# Altium project Cubesat_BMS.PrjPcb (part 1 of 2)
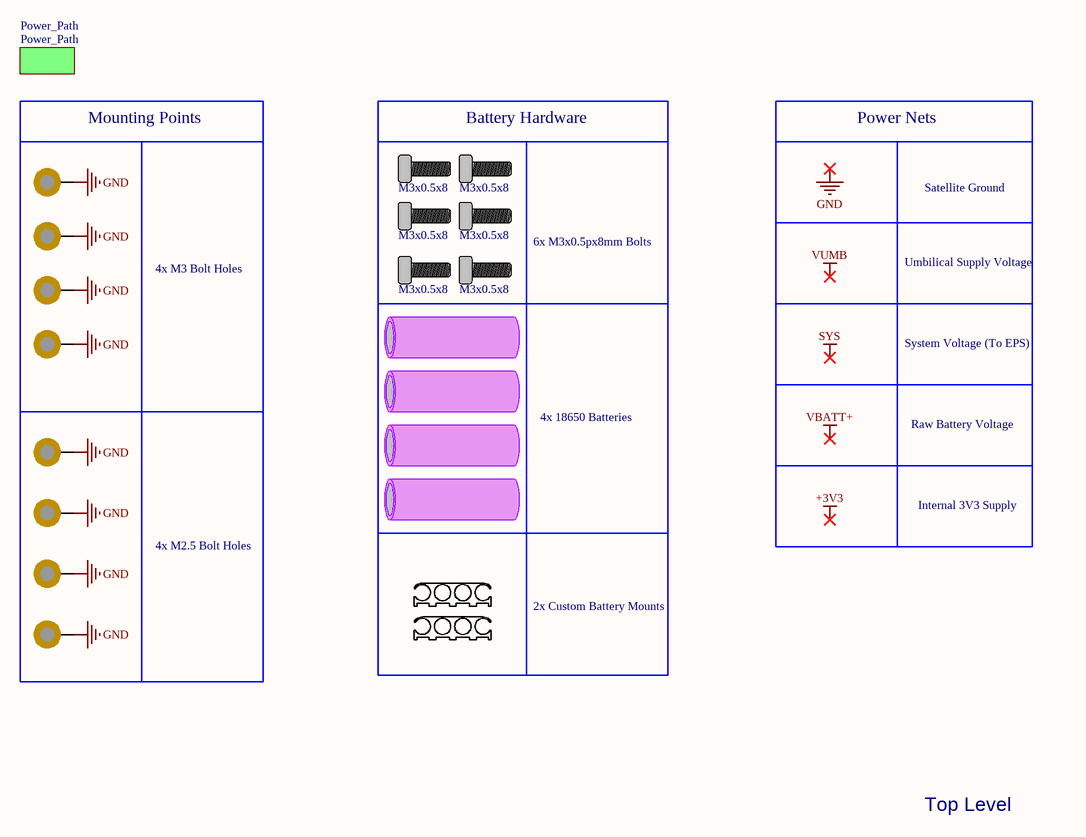
[diagram p0: Top_Level.SchDoc]
Engineer: TH; PCB_Name: BMS; Revision: 1
9 sheets, 235 parts. Net scope: flat (ports and power ports of the same name join across sheets).
Board file: BMS.PcbDoc
Sheets:
  Top_Level.SchDoc
    Power_Path = Power_Path.SchDoc
      Battery = Battery_Protection.SchDoc
      Battery_eFuse = Battery_eFuse.SchDoc
      Umbilical_eFuse = Umbilical_eFuse.SchDoc
      Charger = Charger.SchDoc
      MPPT = MPPT.SchDoc
      Controller = Controller.SchDoc
      Step_Down = Step_Down.SchDoc

## Sheet Top_Level.SchDoc
size 297 x 209 mm; SheetNumber: 1; SheetTotal: 9

### Parts
BAT1  INR18650-35E  (value not drawn)  (mechanical)
BAT2  INR18650-35E  (value not drawn)  (mechanical)
BAT3  INR18650-35E  (value not drawn)  (mechanical)
BAT4  INR18650-35E  (value not drawn)  (mechanical)
MECH1  M3 Mounting Hole  [M3 Mounting Hole]  (value not drawn)  (no BOM)
MECH2  M3 Mounting Hole  [M3 Mounting Hole]  (value not drawn)  (no BOM)
MECH3  M3 Mounting Hole  [M3 Mounting Hole]  (value not drawn)  (no BOM)
MECH4  M3 Mounting Hole  [M3 Mounting Hole]  (value not drawn)  (no BOM)
MECH5  M3x0.5x8  [M3 x 0.50p x 8mm Bolt]
MECH6  M3x0.5x8  [M3 x 0.50p x 8mm Bolt]
MECH7  M3x0.5x8  [M3 x 0.50p x 8mm Bolt]
MECH8  M3x0.5x8  [M3 x 0.50p x 8mm Bolt]
MECH9  M3x0.5x8  [M3 x 0.50p x 8mm Bolt]
MECH10  M3x0.5x8  [M3 x 0.50p x 8mm Bolt]
MECH11  M2.5 Mounting Hole  [M2.5 Mounting Hole]  (value not drawn)
MECH12  M2.5 Mounting Hole  [M2.5 Mounting Hole]  (value not drawn)
MECH13  M2.5 Mounting Hole  [M2.5 Mounting Hole]  (value not drawn)
MECH14  M2.5 Mounting Hole  [M2.5 Mounting Hole]  (value not drawn)

### Blocks framed on the sheet
Mounting Points: MECH1-MECH4
Battery Hardware: BAT1-BAT4 MECH5-MECH10
4x M2.5 Bolt Holes: MECH11-MECH14

### Sub-sheets
Power_Path = Power_Path: no entries

### Nets
GND: MECH1.1 MECH2.1 MECH3.1 MECH4.1 MECH11.1 MECH12.1 MECH13.1 MECH14.1

### Notes on the sheet
- Power Nets
- Satellite Ground
- 6x M3x0.5px8mm Bolts
- Umbilical Supply Voltage
- 4x M3 Bolt Holes
- System Voltage (To EPS)
- 4x 18650 Batteries
- Raw Battery Voltage
- Internal 3V3 Supply
- 2x Custom Battery Mounts
- Top Level
- Labels drawn without touching a wire or pin: +3V3, GND, SYS, VBATT+, VUMB
- Size:
- Title:
- A4
- Project:
- Rev:
- Date:
- Drawn By:
- Sheet:
- of

### Library data of the parts
BAT1-BAT4 = INR18650-35E: Samsung 3500mAh 18650 Li-Ion battery; Continuous Current: 3.5A; Part Number: INR18650-35E; Distributor Part Number: SB2632; Distributor: Jaycar; Capacity: 3500mAh; Operating Temperature: 0°C to 50°C
MECH5-MECH10 = M3x0.5px8mm Bolt: M3 x 0.50p x 8mm Full Thread Metric Coarse Socket Head Cap Screw (2.5mm Key) A4-70 Stainless G316 DIN 912 / ISO 4762; Part Number: M3 x 0.50p x 8mm; Distributor: Bolt and Nut Australia; Distributor Part Number: M3 x 0.50p x 8mm

## Sheet Power_Path.SchDoc
size 297 x 209 mm; SheetNumber: 2; SheetTotal: 9
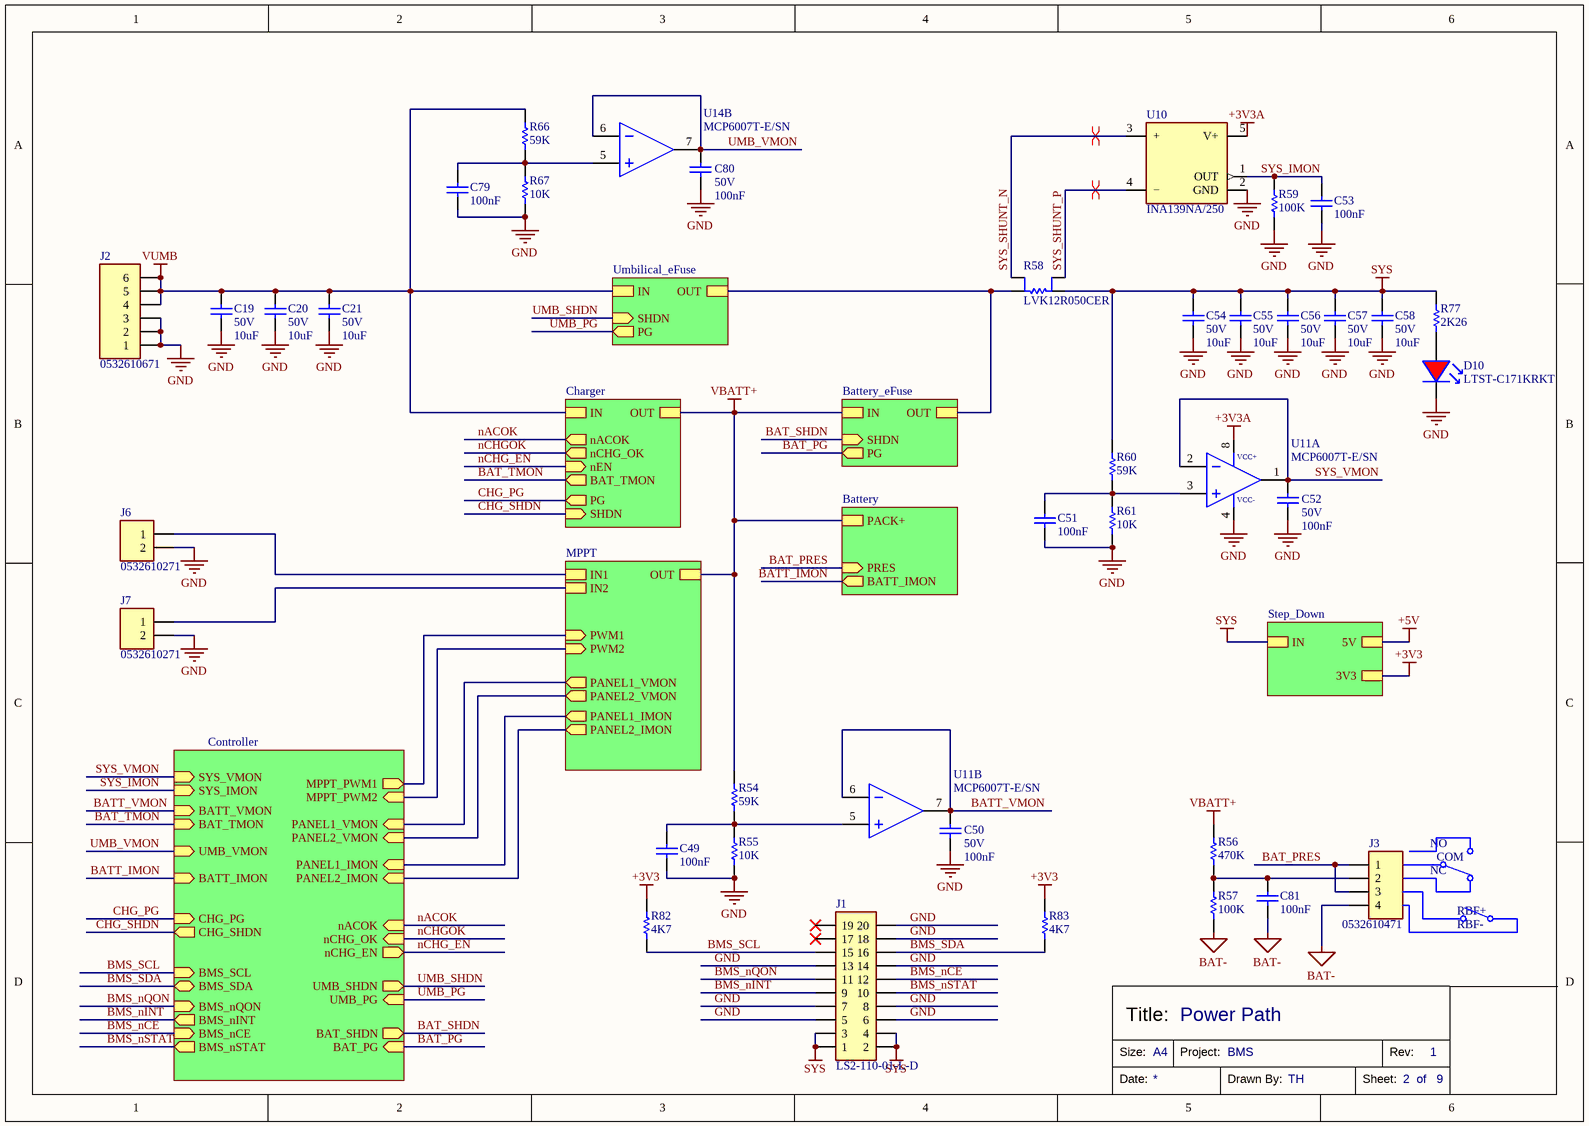
[diagram p1: Power_Path.SchDoc]

### Parts
C19  Voltage Rating: 50V  Capacitance: 10uF  [CAPC1210X090]  (hidden comment: CL32B106KBJNNNE)
C20  Voltage Rating: 50V  Capacitance: 10uF  [CAPC1210X090]  (hidden comment: CL32B106KBJNNNE)
C21  Voltage Rating: 50V  Capacitance: 10uF  [CAPC1210X090]  (hidden comment: CL32B106KBJNNNE)
C49  Capacitance: 100nF  [CAPC0603X040]  (hidden comment: C0603C104K5RACTU)
C50  Voltage Rating: 50V  Capacitance: 100nF  [CAPC0603X040]  (hidden comment: C0603C104K5RACTU)
C51  Capacitance: 100nF  [CAPC0603X040]  (hidden comment: C0603C104K5RACTU)
C52  Voltage Rating: 50V  Capacitance: 100nF  [CAPC0603X040]  (hidden comment: C0603C104K5RACTU)
C53  Capacitance: 100nF  [CAPC0603X040]  (hidden comment: C0603C104K5RACTU)
C54  Voltage Rating: 50V  Capacitance: 10uF  [CAPC1210X090]  (hidden comment: CL32B106KBJNNNE)
C55  Voltage Rating: 50V  Capacitance: 10uF  [CAPC1210X090]  (hidden comment: CL32B106KBJNNNE)
C56  Voltage Rating: 50V  Capacitance: 10uF  [CAPC1210X090]  (hidden comment: CL32B106KBJNNNE)
C57  Voltage Rating: 50V  Capacitance: 10uF  [CAPC1210X090]  (hidden comment: CL32B106KBJNNNE)
C58  Voltage Rating: 50V  Capacitance: 10uF  [CAPC1210X090]  (hidden comment: CL32B106KBJNNNE)
C79  Capacitance: 100nF  [CAPC0603X040]  (hidden comment: C0603C104K5RACTU)
C80  Voltage Rating: 50V  Capacitance: 100nF  [CAPC0603X040]  (hidden comment: C0603C104K5RACTU)
C81  Capacitance: 100nF  [CAPC0603X040]  (hidden comment: C0603C104K5RACTU)
D10  LTST-C171KRKT  [LEDR_0805]
J1  LS2-110-01-L-D  [LS2-110-01-L-D]
J2  0532610671  [0532610671]
J3  0532610471  [0532610471]
J6  0532610271  [0532610271]
J7  0532610271  [0532610271]
R54  Resistance: 59K  [RESC0603]  (hidden comment: RMCF0603FT59K0)
R55  Resistance: 10K  [RESC0603]  (hidden comment: RMCF0603FT10K0)
R56  Resistance: 470K  [RESC0603]  (hidden comment: RMCF0603FT470K)
R57  Resistance: 100K  [RESC0603]  (hidden comment: RMCF0603FT100K)
R58  LVK12R050CER  [LVK12R050CER-1]
R59  Resistance: 100K  [RESC0603]  (hidden comment: RMCF0603FT100K)
R60  Resistance: 59K  [RESC0603]  (hidden comment: RMCF0603FT59K0)
R61  Resistance: 10K  [RESC0603]  (hidden comment: RMCF0603FT10K0)
R66  Resistance: 59K  [RESC0603]  (hidden comment: RMCF0603FT59K0)
R67  Resistance: 10K  [RESC0603]  (hidden comment: RMCF0603FT10K0)
R77  Resistance: 2K26  [RESC0603]  (hidden comment: RMCF0603FT2K26)
R82  Resistance: 4K7  [RESC0603]  (hidden comment: RMCF0603FT4K7)
R83  Resistance: 4K7  [RESC0603]  (hidden comment: RMCF0603FT4K7)
U10  INA139NA/250  [SOT23-5 IC]
U11  MCP6007T-E/SN  [SOIC-8]  (parts A,B of 2)
U14  MCP6007T-E/SN  [SOIC-8]  (part B of 2)

### Sub-sheets
Battery = Battery_Protection: PACK+, PRES (in), BATT_IMON (out)
Battery_eFuse = Battery_eFuse: IN, OUT, SHDN (in), PG (out)
Charger = Charger: IN, OUT, nACOK (out), nCHG_OK (out), nEN (in), BAT_TMON (out), PG (out), SHDN (in)
Controller = Controller: MPPT_PWM1 (out), MPPT_PWM2 (in), PANEL1_VMON (in), PANEL2_VMON (in), PANEL1_IMON (in), PANEL2_IMON (in), nACOK (in), nCHG_OK (in), nCHG_EN (out), UMB_SHDN (out), UMB_PG (in), BAT_SHDN (out), BAT_PG (in), SYS_VMON (in), SYS_IMON (in), BAT_TMON (in), UMB_VMON (in), BATT_IMON (in), CHG_PG (in), CHG_SHDN (out), BATT_VMON (in), BMS_SCL (in), BMS_SDA (bidir), BMS_nINT (out), BMS_nCE (in), BMS_nSTAT (out), BMS_nQON (in)
MPPT = MPPT: IN1, OUT, PWM1 (in), IN2, PWM2 (in), PANEL1_VMON (out), PANEL2_VMON (out), PANEL1_IMON (out), PANEL2_IMON (out)
Step_Down = Step_Down: IN, 5V, 3V3
Umbilical_eFuse = Umbilical_eFuse: IN, OUT, SHDN (in), PG (out)

### Nets
+3V3: R82.2 R83.2 ; sheet Step_Down/3V3
+3V3A: U10.5(V+) U11.8(VCC+)
+5V: sheet Step_Down/5V
BAT-: C81.1 J3.4 R57.1
GND: C19.1 C20.1 C21.1 C49.1 C50.1 C51.1 C52.1 C53.1 C54.1 C55.1 C56.1 C57.1 C58.1 C79.1 C80.1 D10.K J1.5 J1.6 J1.7 J1.8 J1.13 J1.14 J1.18 J1.20 J2.1 J2.2 J2.3 J6.2 J7.2 R55.1 R59.1 R61.1 R67.1 U10.2(GND) U11.4(VCC-)
SYS: C54.2 C55.2 C56.2 C57.2 C58.2 J1.1 J1.2 J1.3 J1.4 R58.4 R60.2 R77.2 ; sheet Step_Down/IN
VBATT+: R54.2 R56.2 ; sheet Battery/PACK+, sheet Battery_eFuse/IN, sheet Charger/OUT, sheet MPPT/OUT
VUMB: C19.2 C20.2 C21.2 J2.4 J2.5 J2.6 R66.2 ; sheet Umbilical_eFuse/IN, sheet Charger/IN
BAT_PG: sheet Battery_eFuse/PG, sheet Controller/BAT_PG
BAT_PRES: J3.1 J3.3 ; sheet Battery/PRES
BAT_SHDN: sheet Battery_eFuse/SHDN, sheet Controller/BAT_SHDN
BAT_TMON: sheet Charger/BAT_TMON, sheet Controller/BAT_TMON
BATT_IMON: sheet Battery/BATT_IMON, sheet Controller/BATT_IMON
BATT_VMON: C50.2 U11.6(INB-) U11.7(OUTB) ; sheet Controller/BATT_VMON
BMS_nCE: J1.12 ; sheet Controller/BMS_nCE
BMS_nINT: J1.9 ; sheet Controller/BMS_nINT
BMS_nQON: J1.11 ; sheet Controller/BMS_nQON
BMS_nSTAT: J1.10 ; sheet Controller/BMS_nSTAT
BMS_SCL: J1.15 R82.1 ; sheet Controller/BMS_SCL
BMS_SDA: J1.16 R83.1 ; sheet Controller/BMS_SDA
CHG_PG: sheet Charger/PG, sheet Controller/CHG_PG
CHG_SHDN: sheet Charger/SHDN, sheet Controller/CHG_SHDN
nACOK: sheet Charger/nACOK, sheet Controller/nACOK
nCHG_EN: sheet Charger/nEN, sheet Controller/nCHG_EN
nCHGOK: sheet Charger/nCHG_OK, sheet Controller/nCHG_OK
SYS_IMON: C53.2 R59.2 U10.1(OUT) ; sheet Controller/SYS_IMON
SYS_SHUNT_N: R58.2 U10.3(+)
SYS_SHUNT_P: R58.3 U10.4(−)
SYS_VMON: C52.2 U11.1(OUTA) U11.2(INA-) ; sheet Controller/SYS_VMON
UMB_PG: sheet Umbilical_eFuse/PG, sheet Controller/UMB_PG
UMB_SHDN: sheet Umbilical_eFuse/SHDN, sheet Controller/UMB_SHDN
UMB_VMON: C80.2 U14.6(INB-) U14.7(OUTB) ; sheet Controller/UMB_VMON
NetC49_2: C49.2 R54.1 R55.2 U11.5(INB+)
NetC51_2: C51.2 R60.1 R61.2 U11.3(INA+)
NetC79_2: C79.2 R66.1 R67.2 U14.5(INB+)
NetC81_2: C81.2 J3.2 R56.1 R57.2
NetD10_A: D10.A R77.1
NetJ6_1: J6.1 ; sheet MPPT/IN1
NetJ7_1: J7.1 ; sheet MPPT/IN2
NetR58_1: R58.1 ; sheet Battery_eFuse/OUT, sheet Umbilical_eFuse/OUT
(unnamed): sheet MPPT/PWM1, sheet Controller/MPPT_PWM1
(unnamed): sheet MPPT/PWM2, sheet Controller/MPPT_PWM2
(unnamed): sheet MPPT/PANEL1_VMON, sheet Controller/PANEL1_VMON
(unnamed): sheet MPPT/PANEL2_VMON, sheet Controller/PANEL2_VMON
(unnamed): sheet MPPT/PANEL1_IMON, sheet Controller/PANEL1_IMON
(unnamed): sheet MPPT/PANEL2_IMON, sheet Controller/PANEL2_IMON

Not connected (* = marked no-connect by the designer): J1 17* 19*

### Layout directives
differential pair: SYS_SHUNT_N, SYS_SHUNT_P

### Notes on the sheet
- (near J3) NC
- (near J3) NO
- (near J3) COM
- RBF+
- RBF-
- Power Path
- Size:
- Title:
- A4
- Project:
- Rev:
- Date:
- Drawn By:
- Sheet:
- of

### Library data of the parts
C19-C21 C54-C58 = CL32B106KBJNNNE: 10 µF ±10% 50V Ceramic Capacitor X7R 1210 (3225 Metric); Manufacturer Part Number: CL32B106KBJNNNE; Distributor Part Number: 1276-3387-1-ND; Tolerance: 10%; Case Code: 1210; Distributor: Digikey
C49-C53 C79-C81 = C0603C104K5RACTU: 0.1 µF ±10% 50V Ceramic Capacitor X7R 0603 (1608 Metric); Part Number: C0603C104K5RACTU; Distributor Part Number: 399-C0603C104K5RACTUCT-ND; Tolerance: 10%; Case Code: 0603; Distributor: Digikey
  C49 C51 C53 C79 C81: Voltage Rating: 50V
D10 = LTST-C171KRKT: Red 631nm LED Indication - Discrete 2V 0805 (2012 Metric); Part Number: LTST-C171KRKT; Distributor Part Number: 160-1427-1-ND; Colour: Red; Operating Temperature: -30℃~+85℃; Distributor: Digikey
J1 = LS2-110-01-L-D: Connector Self Mating 20 Position , Non-Gendered, Hermaphroditic Through Hole Gold; Number of Positions: 20; Contact Rating: 3.2A; Voltage Rating: 475VAC; Part Number: LS2-110-01-L-D; Distributor Part Number: SAM9665-ND; Distributor: Digikey; Number of Rows: 2; Operating Temperature: -55C ~ 125C
J2 = 0532610671: Connector Header Surface Mount, Right Angle 6 position 0.049" (1.25mm) Picoblade; Number of Positions: 6; Contact Current (Max): 1A; Material Flammability Rating: UL94 V-0; Part Number: 0532610671; Distributor Part Number: WM7624CT-ND; Distributor: Digikey
J3 = 0532610471: Connector Header Surface Mount, Right Angle 4 position 0.049" (1.25mm) Molex Picoblade; Number of Positions: 4; Max Current Per Contact: 1A; Part Number: 0532610471; Distributor: Digikey; Distributor Part Number: WM7622CT-ND; Number of Rows: 2
J6 J7 = 0532610271: Connector Header, Picoblade Surface Mount, Right Angle 2 position 0.049" (1.25mm); Number of Positions: 2; Max Current Per Contact: 1A; Part Number: 0532610271; Distributor: Digikey; Distributor Part Number: WM7620CT-ND; Number of Rows: 1
R54 R60 R66 = RMCF0603FT59K0: 59 kOhms ±1% 0.1W, 1/10W Chip Resistor 0603 (1608 Metric) Automotive AEC-Q200 Thick Film; Part Number: RMCF0603FT59K0; Tolerance: 1%; Distributor Part Number: RMCF0603FT59K0CT-ND; Distributor: Digikey; Case Code: 0603
R55 R61 R67 = RMCF0603FT10K0: 10 kOhms ±1% 0.1W, 1/10W Chip Resistor 0603 (1608 Metric) Automotive AEC-Q200 Thick Film; Part Number: RMCF0603FT10K0; Tolerance: 1%; Distributor: Digikey; Distributor Part Number: RMCF0603FT10K0CT-ND; Case Code: 0603
R56 = RMCF0603FT470K: 470 kOhms ±1% 0.1W, 1/10W Chip Resistor 0603 (1608 Metric) Automotive AEC-Q200 Thick Film; Part Number: RMCF0603FT470K; Tolerance: 1%; Distributor: Digikey; Distributor Part Number: RMCF0603FT470KCT-ND; Case Code: 0603
R57 R59 = RMCF0603FT100K: 100 kOhms ±1% 0.1W, 1/10W Chip Resistor 0603 (1608 Metric) Automotive AEC-Q200 Thick Film; Part Number: RMCF0603FT100K; Tolerance: 1%; Distributor: Digikey; Distributor Part Number: RMCF0603FT100KCT-ND; Case Code: 0603
R58 = LVK12R050CER: Resistor, Current Sense 50 mOhms ±0.25% 0.5W, Moisture Resistant Thick Film; Manufacturer: Ohmite; Temperature Coefficient: ±50ppm/°C; Resistance: 50mOhm; Part Number: LVK12R050CER; Distributor: Mouser; Distributor Part Number: 588-LVK12R050CER; Power: 0.5W; Tolerance: 0.25%
R77 = RMCF0603FT2K26: 2.26 kOhms ±1% 0.1W, 1/10W Chip Resistor 0603 (1608 Metric) Automotive AEC-Q200 Thick Film; Part Number: RMCF0603FT2K26; Tolerance: 1%; Distributor Part Number: RMCF0603FT2K26CT-ND; Distributor: Digikey; Case Code: 0603
R82 R83 = RMCF0603FT4K7: 4.7 kOhms ±1% 0.1W, 1/10W Chip Resistor 0603 (1608 Metric) Automotive AEC-Q200 Thick Film; Part Number: RMCF0603FT4K7; Tolerance: 1%; Distributor: Digikey; Distributor Part Number: RMCF0603FT4K70CT-ND; Case Code: 0603
U10 = INA139NA/250: 40V Current Sense Amplifier 1 Circuit 8-MSOP; Accuracy: 0.5%; Distributor: Digikey; Distributor Part Number: INA139NA/250CT-ND; Operating Temperature: -40°C ~ 125°C; Part Number: INA139NA/250
U11 U14 = MCP6007T-E/SN: Operational Amplifier general purpose, 2-Circuit 1.8V ~ 5.5V 1MHz; Slew Rate: 1.9V/us; Part Number: MCP6007T-E/SN; Distributor: Digikey; Distributor Part Number: 150-MCP6007T-E/SNCT-ND; Input Voltage: 1.8V ~ 5.5V; Operating Temperature: -40°C ~ 125°C; Gain Bandwidth Product: 1MHz

## Sheet Battery_Protection.SchDoc
size 297 x 209 mm; SheetNumber: 3; SheetTotal: 9
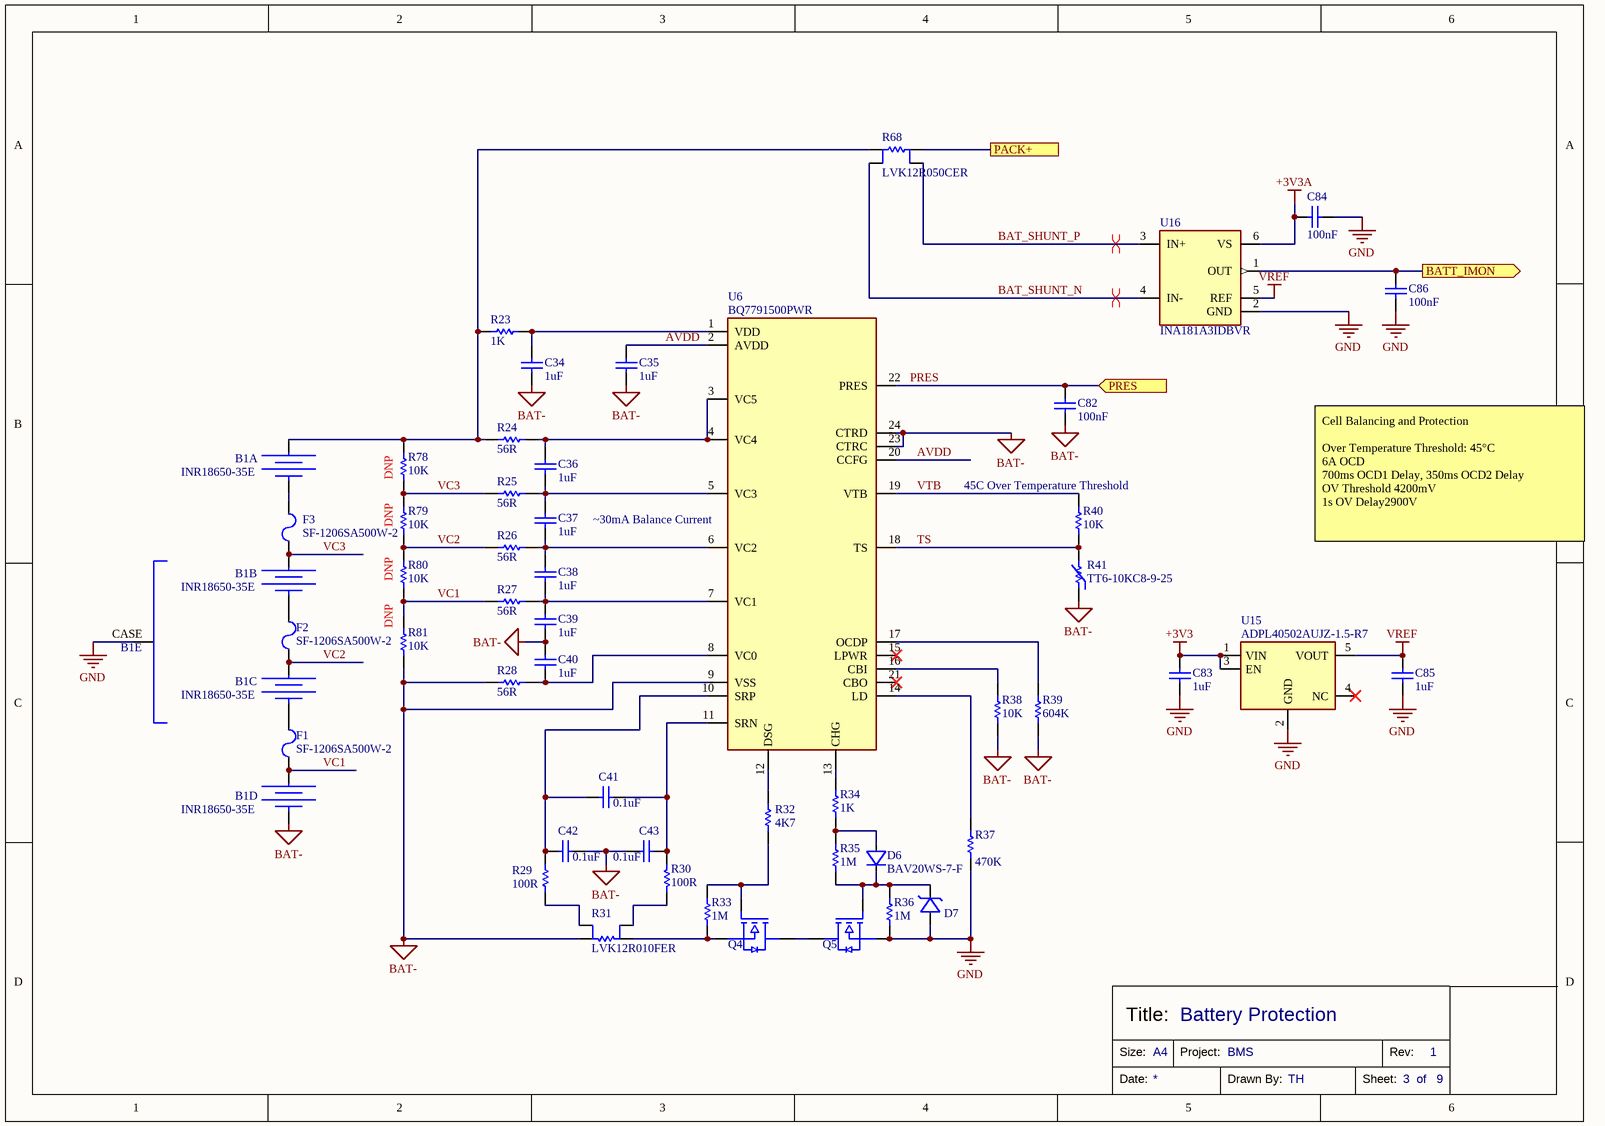
[diagram p2: Battery_Protection.SchDoc]

### Parts
B1  INR18650-35E  [4S Battery Direct Solder]  (parts A,B,C,D,E of 5)
C34  Capacitance: 1uF  [CAPC0603X040]  (hidden comment: CL10A105KB8NNNC)
C35  Capacitance: 1uF  [CAPC0603X040]  (hidden comment: CL10A105KB8NNNC)
C36  Capacitance: 1uF  [CAPC0603X040]  (hidden comment: CL10A105KB8NNNC)
C37  Capacitance: 1uF  [CAPC0603X040]  (hidden comment: CL10A105KB8NNNC)
C38  Capacitance: 1uF  [CAPC0603X040]  (hidden comment: CL10A105KB8NNNC)
C39  Capacitance: 1uF  [CAPC0603X040]  (hidden comment: CL10A105KB8NNNC)
C40  Capacitance: 1uF  [CAPC0603X040]  (hidden comment: CL10A105KB8NNNC)
C41  Capacitance: 0.1uF  [CAPC0402X020]  (hidden comment: CL05B104KB5NNNC)
C42  Capacitance: 0.1uF  [CAPC0402X020]  (hidden comment: CL05B104KB5NNNC)
C43  Capacitance: 0.1uF  [CAPC0402X020]  (hidden comment: CL05B104KB5NNNC)
C82  Capacitance: 100nF  [CAPC0603X040]  (hidden comment: C0603C104K5RACTU)
C83  Capacitance: 1uF  [CAPC0603X040]  (hidden comment: CL10A105KB8NNNC)
C84  Capacitance: 100nF  [CAPC0603X040]  (hidden comment: C0603C104K5RACTU)
C85  Capacitance: 1uF  [CAPC0603X040]  (hidden comment: CL10A105KB8NNNC)
C86  Capacitance: 100nF  [CAPC0603X040]  (hidden comment: C0603C104K5RACTU)
D6  BAV20WS-7-F  [SOD-323]
D7  BZT52C12T-7  [SOD-523]  (value not drawn)
F1  SF-1206SA500W-2  [SF-1206SA300W-2]
F2  SF-1206SA500W-2  [SF-1206SA300W-2]
F3  SF-1206SA500W-2  [SF-1206SA300W-2]
Q4  BSC026N08NS5  [PG-TDSON-8-5]  (value not drawn)
Q5  BSC026N08NS5  [PG-TDSON-8-5]  (value not drawn)
R23  Resistance: 1K  [RESC0603]  (hidden comment: RMCF0603FT1K00)
R24  Resistance: 56R  [RESC0603]  (hidden comment: RMCF0603FT56R0)
R25  Resistance: 56R  [RESC0603]  (hidden comment: RMCF0603FT56R0)
R26  Resistance: 56R  [RESC0603]  (hidden comment: RMCF0603FT56R0)
R27  Resistance: 56R  [RESC0603]  (hidden comment: RMCF0603FT56R0)
R28  Resistance: 56R  [RESC0603]  (hidden comment: RMCF0603FT56R0)
R29  Resistance: 100R  [RESC0603]  (hidden comment: RMCF0603FT100R)
R30  Resistance: 100R  [RESC0603]  (hidden comment: RMCF0603FT100R)
R31  LVK12R010FER  [LVK12R050CER-2]
R32  Resistance: 4K7  [RESC0603]  (hidden comment: RMCF0603FT4K7)
R33  Resistance: 1M  [RESC0603]  (hidden comment: RMCF0603FT1M00)
R34  Resistance: 1K  [RESC0603]  (hidden comment: RMCF0603FT1K00)
R35  Resistance: 1M  [RESC0603]  (hidden comment: RMCF0603FT1M00)
R36  Resistance: 1M  [RESC0603]  (hidden comment: RMCF0603FT1M00)
R37  Resistance: 470K  [RESC0603]  (hidden comment: RMCF0603FT470K)
R38  Resistance: 10K  [RESC0603]  (hidden comment: RMCF0603FT10K0)
R39  Resistance: 604K  [RESC0603]  (hidden comment: RMCF0603FT604K)
R40  Resistance: 10K  [RESC0603]  (hidden comment: RMCF0603FT10K0)
R41  TT6-10KC8-9-25  [TT6-10KC8-9-25]
R68  LVK12R050CER  [LVK12R050CER-2]
R78  Resistance: 10K  [RESC0603]  (hidden comment: RMCF0603FT10K0)
R79  Resistance: 10K  [RESC0603]  (hidden comment: RMCF0603FT10K0)
R80  Resistance: 10K  [RESC0603]  (hidden comment: RMCF0603FT10K0)
R81  Resistance: 10K  [RESC0603]  (hidden comment: RMCF0603FT10K0)
U6  BQ7791500PWR  [TSSOP-24]
U15  ADPL40502AUJZ-1.5-R7  [SOT23-5 IC]
U16  INA181A3IDBVR  [SOT23-6 IC]

### Ports
BATT_IMON (out, see Power_Path[4C], Controller[2C]), PACK+ (see Power_Path[4B]), PRES (in, see Power_Path[4C])

### Nets
+3V3: C83.2 U15.1(VIN) U15.3(EN)
+3V3A: C84.1 U16.6(VS)
BAT-: B1.7 C34.1 C35.1 C39.1 C40.2 C42.2 C43.1 C82.1 R28.1 R31.1 R38.1 R39.1 R41.1 R81.1 U6.9(VSS) U6.23(CTRC) U6.24(CTRD)
GND: B1.CASE C83.1 C84.2 C85.1 C86.1 D7.A Q5.S R36.1 R37.1 U15.2(GND) U16.2(GND)
VREF: C85.2 U15.5(VOUT) U16.5(REF)
AVDD: C35.2 U6.2(AVDD) U6.20(CCFG)
BAT_SHUNT_N: R68.2 U16.4(IN-)
BAT_SHUNT_P: R68.3 U16.3(IN+)
PRES: C82.2 U6.22(PRES) ; port PRES
TS: R40.1 R41.2 U6.18(TS)
VC1: B1.8 F1.1 R27.1 R80.1 R81.2
VC2: B1.6 F2.1 R26.1 R79.1 R80.2
VC3: B1.4 F3.1 R25.1 R78.1 R79.2
VTB: R40.2 U6.19(VTB)
NetB1_1: B1.1 F3.2
NetB1_2: B1.2 R23.1 R24.1 R68.1 R78.2
NetB1_3: B1.3 F2.2
NetB1_5: B1.5 F1.2
NetC34_2: C34.2 R23.2 U6.1(VDD)
NetC36_1: C36.1 C37.2 R25.2 U6.5(VC3)
NetC36_2: C36.2 R24.2 U6.3(VC5) U6.4(VC4)
NetC37_1: C37.1 C38.2 R26.2 U6.6(VC2)
NetC38_1: C38.1 C39.2 R27.2 U6.7(VC1)
NetC40_1: C40.1 R28.2 U6.8(VC0)
NetC41_1: C41.1 C42.1 R29.2 U6.10(SRP)
NetC41_2: C41.2 C43.2 R30.2 U6.11(SRN)
NetC86_2: C86.2 U16.1(OUT) ; port BATT_IMON
NetD6_A: D6.A R34.1 R35.2
NetD6_K: D6.K D7.K Q5.G R35.1 R36.2
NetQ4_D: Q4.D Q5.D
NetQ4_G: Q4.G R32.1 R33.2
NetQ4_S: Q4.S R31.4 R33.1
NetR29_1: R29.1 R31.2
NetR30_1: R30.1 R31.3
NetR32_2: R32.2 U6.12(DSG)
NetR34_2: R34.2 U6.13(CHG)
NetR37_2: R37.2 U6.14(LD)
NetR38_2: R38.2 U6.16(CBI)
NetR39_2: R39.2 U6.17(OCDP)
NetR68_4: R68.4 ; port PACK+

Not connected (* = marked no-connect by the designer): U6 15(LPWR)* 21(CBO)*; U15 4(NC)*

### Layout directives
differential pair: BAT_SHUNT_N, BAT_SHUNT_P

### Notes on the sheet
- (near R78) DNP
- (near R79) DNP
- (near U6) ~30mA Balance Current
- (near R40) 45C Over Temperature Threshold
- Cell Balancing and Protection
  Over Temperature Threshold: 45°C
  6A OCD
  700ms OCD1 Delay, 350ms OCD2 Delay
  OV Threshold 4200mV
  1s OV Delay2900V
- (near R80) DNP
- (near R81) DNP
- Battery Protection
- Size:
- Title:
- A4
- Project:
- Rev:
- Date:
- Drawn By:
- Sheet:
- of

### Library data of the parts
B1 = 4S Battery Split: Custom 4S battery component for Cubesat EPS; Part Number: N/A; Distributor Part Number: N/A
C34-C40 C83 C85 = CL10A105KB8NNNC: 1uF 50V X5R ±10% 0603 Multilayer Ceramic Capacitors MLCC - SMD/SMT ROHS; Part Number: CL10A105KB8NNNC; Tolerance: 10%; Distributor Part number: C15849; Case Code: 0603; Distributor: JLCPCB; Dielectric: X5R; Voltage Rating: 50V
C41-C43 = CL05B104KB5NNNC: 0.1 µF ±10% 50V Ceramic Capacitor X7R 0402 (1005 Metric); Part Number: CL05B104KB5NNNC; Tolerance: 10%; Distributor Part Number: 1276-CL05B104KB5NNNCCT-ND; Case Code: 0402; Distributor: Digikey; Voltage Rating: 50V
C82 C84 C86 = C0603C104K5RACTU: as C49 on sheet Power_Path; Part Number: C0603C104K5RACTU; Tolerance: 10%; Distributor Part Number: 399-C0603C104K5RACTUCT-ND; Case Code: 0603; Distributor: Digikey; Voltage Rating: 50V
D6 = BAV20WS-7-F0: Small Signal Switching Diode 150V 200mW; Vr (Max): 200; Ir (Max): 100n; Ifsm: 3@100us; Operating Temperature: -55 to 150C; Part Number: BAV20WS-7-F; Distributor: Digikey; Distributor Part Number: BAV20WS-FDICT-ND
D7 = BZT52C12T-7: Zener Diode 12 V 300 mW ±5% Surface Mount SOD-523; Voltage - Zener: 12V; Power - Max: 300mW; Part Number: BZT52C12T-7; Distributor Part Number: 621-BZT52C12T-7; Operating Temperature: -65°C ~ 150°C; Distributor: Mouser
F1-F3 = SF-1206SA300W-2: Fuse Surface Mount 5A Slow Blow 50A Interrupt 1206; Interrupt Rating: 50A at 125VAC 50A at 125VDC; Fuse Size: 9.73 mm x 5.03 mm; Min Temperature: -55C; Max Temperature: 125C; Voltage Rating - DC: 65V; Current Rating: 5A; Distributor: Digikey; Distributor Part Number: 118-SF-1206SA500W-2CT-ND; Breaking Capacity: 50A; Part Number: SF-1206SA500W-2
Q4 Q5 = BSC026N08NS5: 80V N-Channel 23A (Ta), 100A (Tc) 2.5W (Ta), 156W (Tc) Surface Mount PG-TDSON-8-6; Vgs (Max): 20; Vds (Max): 4; Qg: 92nC@10V; Vth: 3.8V; Id: 23; Power Dissipation: 3.1W; Drive Voltage: 6V~10V; Rds On (Max) @ Id, Vgs: 2.6mOhm @ 50A, 10V; Manufacturer Part Number: BSC026N08NS5; Distributor Part Number: 726-BSC026N08NS5ATMA; Distributor: Mouser; Operating Temperature: -55°C ~ 150°C (TJ); Power Dissipation (Max): 2.5W (Ta), 156W (Tc)
R23 R34 = RMCF0603FT1K00: 1 kOhms ±1% 0.1W, 1/10W Chip Resistor 0603 (1608 Metric) Automotive AEC-Q200 Thick Film; Part Number: RMCF0603FT1K00; Tolerance: 1%; Distributor Part Number: RMCF0603FT1K00CT-ND; Distributor: Digikey; Case Code: 0603
R24-R28 = RMCF0603FT56R0: 56 Ohms ±1% 0.1W, 1/10W Chip Resistor 0603 (1608 Metric) Automotive AEC-Q200 Thick Film; Part Number: RMCF0603FT56R0; Tolerance: 1%; Distributor Part Number: RMCF0603FT56R0CT-ND; Distributor: Digikey; Case Code: 0603
R29 R30 = RMCF0603FT100R: 100 Ohms ±1% 0.1W, 1/10W Chip Resistor 0603 (1608 Metric) Automotive AEC-Q200 Thick Film; Part Number: RMCF0603FT100R; Tolerance: 1%; Distributor Part Number: RMCF0603FT100RCT-ND; Distributor: Digikey; Case Code: 0603
R31 = LVK12R010FER: 10 mOhms ±1% 0.5W, 1/2W Chip Resistor 1206 (3216 Metric) Anti-Corrosive, Current Sense, Moisture Resistant Thick Film; Manufacturer: Ohmite; Tolerance: 0.25%; Temperature Coefficient: ±50ppm/°C; Resistance: 10mOhm; Part Number: LVK12R010FER; Distributor: Digikey; Distributor Part Number: 273-LVK12R010FERCT-ND; Power: 0.5W
R32 = RMCF0603FT4K7: as R82 on sheet Power_Path; Part Number: RMCF0603FT4K7; Tolerance: 1%; Distributor Part Number: RMCF0603FT4K70CT-ND; Distributor: Digikey; Case Code: 0603
R33 R35 R36 = RMCF0603FT1M00: 1 MOhms ±1% 0.1W, 1/10W Chip Resistor 0603 (1608 Metric) Automotive AEC-Q200 Thick Film; Part Number: RMCF0603FT1M00; Tolerance: 1%; Distributor Part Number: RMCF0603FT1M00CT-ND; Distributor: Digikey; Case Code: 0603
R37 = RMCF0603FT470K: as R56 on sheet Power_Path; Part Number: RMCF0603FT470K; Tolerance: 1%; Distributor Part Number: RMCF0603FT470KCT-ND; Distributor: Digikey; Case Code: 0603
R38 R40 R78-R81 = RMCF0603FT10K0: as R55 on sheet Power_Path; Part Number: RMCF0603FT10K0; Tolerance: 1%; Distributor: Digikey; Distributor Part Number: RMCF0603FT10K0CT-ND; Case Code: 0603
R39 = RMCF0603FT604K: 604 kOhms ±1% 0.1W, 1/10W Chip Resistor 0603 (1608 Metric) Automotive AEC-Q200 Thick Film; Part Number: RMCF0603FT604K; Tolerance: 1%; Distributor Part Number: RMCF0603FT604KCT-ND; Distributor: Digikey; Case Code: 0603
R41 = TT6-10KC8-9-25: NTC Thermistor 10k Probe; Part Number: TT6-10KC8-9-25; Distributor Part Number: 1912-TT6-10KC8-9-25-ND; Distributor: Digikey; Operating Temperature: -30°C ~ 120°C; Resistance @ 25C: 10k
R68 = LVK12R050CER: as R58 on sheet Power_Path; Part Number: LVK12R050CER; Distributor: Mouser; Distributor Part Number: 588-LVK12R050CER; Power: 0.5W; Tolerance: 0.25%
U6 = BQ7791500PWR: Battery Battery Protection IC Lithium Ion/Polymer 24-TSSOP; OV Threshold: 4200mV; OV Delay: 1s; UV Threshold: 2900mV; Part Number: BQ7791500PWR; Distributor: Digikey; Distributor Part Number: 296-50995-1-ND; Operating Temperature: -25C~85C; UV Delay: 1s
U15 = ADPL40502AUJZ-1.5-R7: Linear Voltage Regulator IC Positive Fixed 1.5V Output 200mA TSOT-23-5; Voltage Dropout (Max): 0.23V @ 200mA; Voltage - Input (Max): 5.5V; Part Number: ADPL40502AUJZ-1.5-R7; Distributor: Digikey; Distributor Part Number: 505-ADPL40502AUJZ-1.5-R7CT-ND; Operating Temperature: -40°C ~ 125°C (TA); Current - Output: 200mA; Voltage Output: 1.5V
U16 = INA181A3IDBVR: Current Sense Amplifier Bidirectional 100V/V; Accuracy: 0.5%; Distributor: Digikey; Distributor Part Number: 296-47658-1-ND; Operating Temperature: -40°C ~ 125°C; Part Number: INA181A3IDBVR; Gain: 100V/V

## Sheet Battery_eFuse.SchDoc
size 297 x 209 mm; SheetNumber: 4; SheetTotal: 9
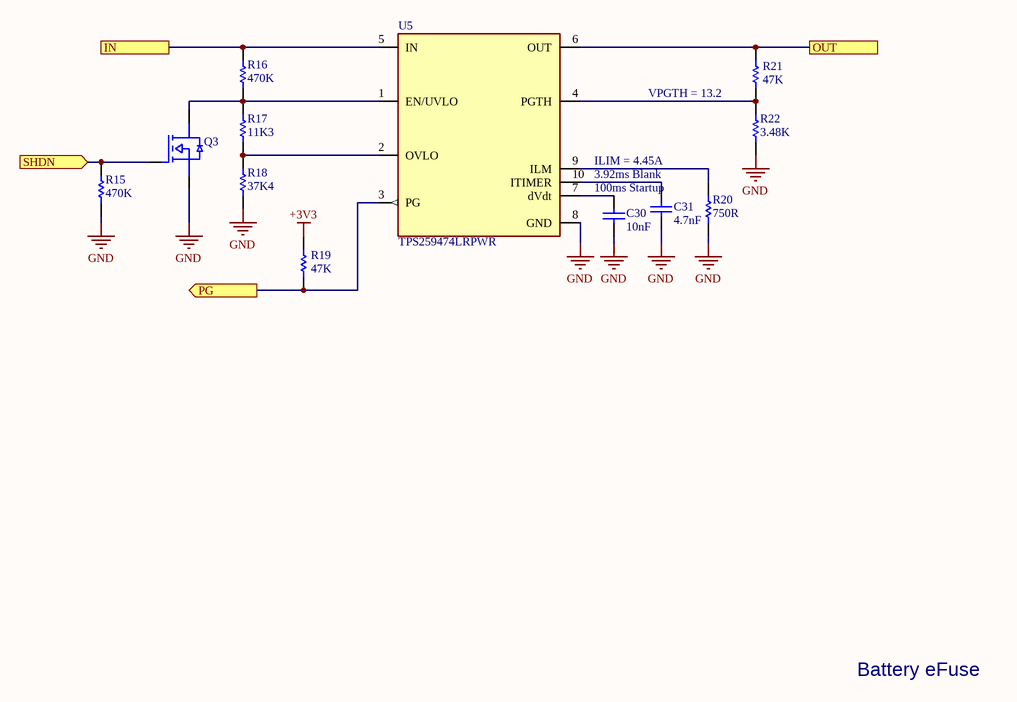
[diagram p3: Battery_eFuse.SchDoc]

### Parts
C30  Capacitance: 10nF  [CAPC0603X060]  (hidden comment: CL10B103KB8NNNC)
C31  Capacitance: 4.7nF  [CAPC0603X040]  (hidden comment: C0603C472K4RECAUTO)
Q3  T2N7002AK,LM  [SOT23-3 MOSFET]  (value not drawn)
R15  Resistance: 470K  [RESC0603]  (hidden comment: RMCF0603FT470K)
R16  Resistance: 470K  [RESC0603]  (hidden comment: RMCF0603FT470K)
R17  Resistance: 11K3  [RESC0603]  (hidden comment: RMCF0603FT11K3)
R18  Resistance: 37K4  [RESC0603]  (hidden comment: RMCF0603FT37K4)
R19  Resistance: 47K  [RESC0603]  (hidden comment: RMCF0603FT47K0)
R20  Resistance: 750R  [RESC0603]  (hidden comment: RMCF0603FT750R)
R21  Resistance: 47K  [RESC0603]  (hidden comment: RMCF0603FT47K0)
R22  Resistance: 3.48K  [RESC0603]  (hidden comment: RMCF0603FT3K48)
U5  TPS259474LRPWR  [VFQFN-10]

### Ports
IN (see Power_Path[4B]), OUT (see Power_Path[4B], Umbilical_eFuse[5B]), PG (out, see Power_Path[4B]), SHDN (in, see Power_Path[4B])

### Nets
+3V3: R19.2
GND: C30.1 C31.1 Q3.S R15.1 R18.1 R20.1 R22.1 U5.8(GND)
NetC6_2: R21.2 U5.6(OUT) ; port OUT
NetC30_2: C30.2 U5.7(dVdt)
NetC31_2: C31.2 U5.10(ITIMER)
NetC59_2: R16.2 U5.5(IN) ; port IN
NetQ3_D: Q3.D R16.1 R17.2 U5.1(EN/UVLO)
NetQ3_G: Q3.G R15.2 ; port SHDN
NetR17_1: R17.1 R18.2 U5.2(OVLO)
NetR19_1: R19.1 U5.3(PG) ; port PG
NetR20_2: R20.2 U5.9(ILM)
NetR21_1: R21.1 R22.2 U5.4(PGTH)

### Notes on the sheet
- VPGTH = 13.2
- ILIM = 4.45A
- 3.92ms Blank
- 100ms Startup
- Battery eFuse
- Size:
- Title:
- A4
- Project:
- Rev:
- Date:
- Drawn By:
- Sheet:
- of

### Library data of the parts
C30 = CL10B103KB8NNNC: 10nF ±10% 50V Ceramic Capacitor X7R 0603 (1608 Metric); Part Number: CL10B103KB8NNNC; Distributor Part Number: 1276-1009-1-ND; Tolerance: 10%; Case Code: 0603; Distributor: Digikey; Voltage Rating: 50V
C31 = C0603C472K4RECAUTO: 4.7nF ±10% 16V Ceramic Capacitor X7R 0603 (1608 Metric); Part Number: C0603C472K4RECAUTO; Tolerance: 10%; Distributor Part number: 399-17879-1-ND; Case Code: 0603; Distributor: Digikey; Dielectric: X7R; Voltage Rating: 16V
Q3 = T2N7002AK,LM: N-Channel 60 V 200mA (Ta) 320mW (Ta) Surface Mount SOT-23-3; Drain to Source Voltage: 60V; Rds On (Max) @ Id, Vgs: 3.9ohm; Vgs(th) (Max) @ Id: 2.1V @ 250µA; (Id) @ 25°C: 200mA; Vgs (Max): *; Power Dissipation (Max): 320mW (Ta); Operating Temperature: -55C - 150C; Part Number: T2N7002AK,LM; Distributor Part Number: T2N7002AKLMCT-ND; Distributor: Digikey
R15 R16 = RMCF0603FT470K: as R56 on sheet Power_Path; Part Number: RMCF0603FT470K; Tolerance: 1%; Distributor: Digikey; Distributor Part Number: RMCF0603FT470KCT-ND; Case Code: 0603
R17 = RMCF0603FT11K3: 11.3 kOhms ±1% 0.1W, 1/10W Chip Resistor 0603 (1608 Metric) Automotive AEC-Q200 Thick Film; Part Number: RMCF0603FT11K3; Distributor: Digikey; Distributor Part Number: RMCF0603FT11K3CT-ND; Case Code: 0603; Tolerance: 1%
R18 = RMCF0603FT37K4: 37.4 kOhms ±1% 0.1W, 1/10W Chip Resistor 0603 (1608 Metric) Automotive AEC-Q200 Thick Film; Part Number: RMCF0603FT37K4; Tolerance: 1%; Distributor: Digikey; Distributor Part Number: RMCF0603FT37K4CT-ND; Case Code: 0603
R19 R21 = RMCF0603FT47K0: 47 kOhms ±1% 0.1W, 1/10W Chip Resistor 0603 (1608 Metric) Automotive AEC-Q200 Thick Film; Part Number: RMCF0603FT47K0; Tolerance: 1%; Distributor Part Number: RMCF0603FT47K0CT-ND; Distributor: Digikey; Case Code: 0603
R20 = RMCF0603FT750R: 750 Ohms ±1% 0.1W, 1/10W Chip Resistor 0603 (1608 Metric) Automotive AEC-Q200 Thick Film; Part Number: RMCF0603FT750R; Tolerance: 1%; Distributor: Digikey; Distributor Part Number: RMCF0603FT750RCT-ND; Case Code: 0603
R22 = RMCF0603FT3K48: 3.48 kOhms ±1% 0.1W, 1/10W Chip Resistor 0603 (1608 Metric) Automotive AEC-Q200 Thick Film; Part Number: RMCF0603FT3K48; Tolerance: 1%; Distributor: Digikey; Distributor Part Number: RMCF0603FT3K48CT-ND; Case Code: 0603
U5 = TPS259474LRPWR: eFuse 5.5A, 2.7V~23V, 28mOhm, Reverse Current Blocking with Input Reverse Polarity Protection; Part Number: TPS259474LRPWR; Distributor: Digikey; Distributor Part Number: 296-TPS259474LRPWRCT-ND; Operating Temperature: -40°C ~ 125°C; Output Current: 5.5A; Voltage Input: 2.7V~23V

## Sheet Umbilical_eFuse.SchDoc
size 297 x 209 mm; SheetNumber: 8; SheetTotal: 9
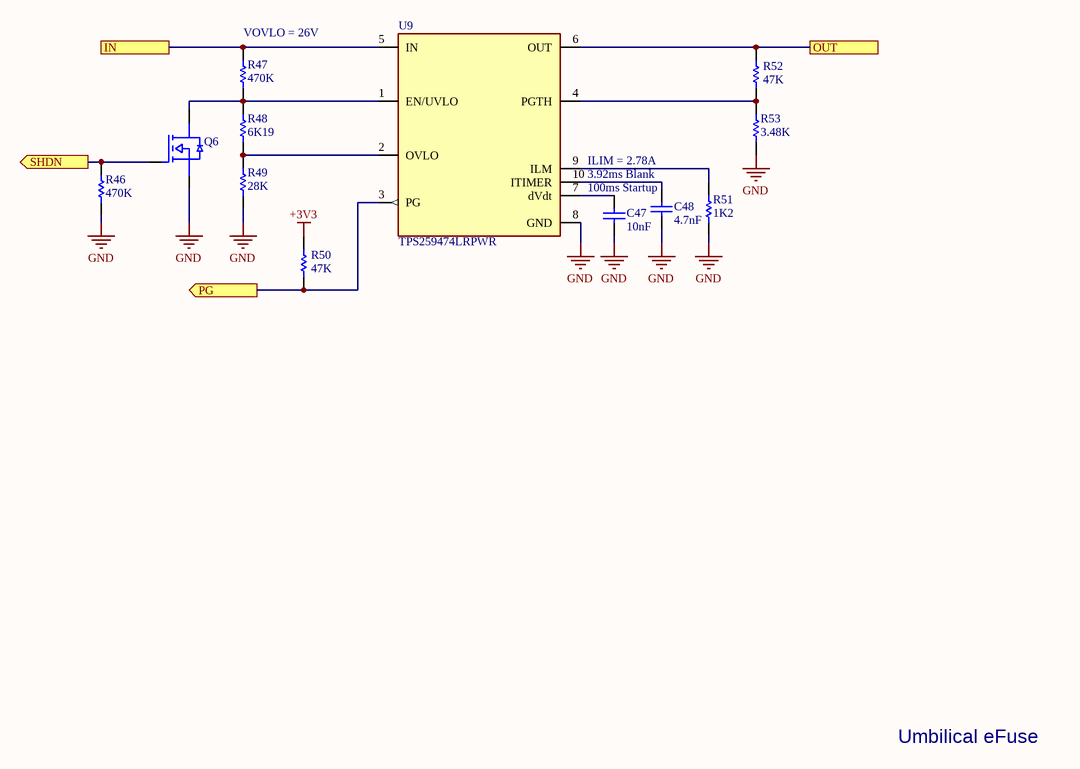
[diagram p4: Umbilical_eFuse.SchDoc]

### Parts
C47  Capacitance: 10nF  [CAPC0603X060]  (hidden comment: CL10B103KB8NNNC)
C48  Capacitance: 4.7nF  [CAPC0603X040]  (hidden comment: C0603C472K4RECAUTO)
Q6  T2N7002AK,LM  [SOT23-3 MOSFET]  (value not drawn)
R46  Resistance: 470K  [RESC0603]  (hidden comment: RMCF0603FT470K)
R47  Resistance: 470K  [RESC0603]  (hidden comment: RMCF0603FT470K)
R48  Resistance: 6K19  [RESC0603]  (hidden comment: RMCF0603FT6K19)
R49  Resistance: 28K  [RESC0603]  (hidden comment: RMCF0603FT28K0)
R50  Resistance: 47K  [RESC0603]  (hidden comment: RMCF0603FT47K0)
R51  Resistance: 1K2  [RESC0603]  (hidden comment: RMCF0603FT1K2)
R52  Resistance: 47K  [RESC0603]  (hidden comment: RMCF0603FT47K0)
R53  Resistance: 3.48K  [RESC0603]  (hidden comment: RMCF0603FT3K48)
U9  TPS259474LRPWR  [VFQFN-10]

### Ports
IN (see Power_Path[3B], Charger[1B]), OUT (see Power_Path[3B], Battery_eFuse[5B]), PG (out, see Power_Path[3B]), SHDN (out, see Power_Path[3B])

### Nets
+3V3: R50.2
GND: C47.1 C48.1 Q6.S R46.1 R49.1 R51.1 R53.1 U9.8(GND)
NetC6_2: R52.2 U9.6(OUT) ; port OUT
NetC47_2: C47.2 U9.7(dVdt)
NetC48_2: C48.2 U9.10(ITIMER)
NetC59_2: R47.2 U9.5(IN) ; port IN
NetQ3_G: Q6.G R46.2 ; port SHDN
NetQ6_D: Q6.D R47.1 R48.2 U9.1(EN/UVLO)
NetR19_1: R50.1 U9.3(PG) ; port PG
NetR48_1: R48.1 R49.2 U9.2(OVLO)
NetR51_2: R51.2 U9.9(ILM)
NetR52_1: R52.1 R53.2 U9.4(PGTH)

### Notes on the sheet
- (near R47) VOVLO = 26V
- ILIM = 2.78A
- 3.92ms Blank
- 100ms Startup
- Umbilical eFuse
- Size:
- Title:
- A4
- Project:
- Rev:
- Date:
- Drawn By:
- Sheet:
- of

### Library data of the parts
C47 = CL10B103KB8NNNC: as C30 on sheet Battery_eFuse; Part Number: CL10B103KB8NNNC; Distributor Part Number: 1276-1009-1-ND; Tolerance: 10%; Case Code: 0603; Distributor: Digikey; Voltage Rating: 50V
C48 = C0603C472K4RECAUTO: as C31 on sheet Battery_eFuse; Part Number: C0603C472K4RECAUTO; Tolerance: 10%; Distributor Part number: 399-17879-1-ND; Case Code: 0603; Distributor: Digikey; Dielectric: X7R; Voltage Rating: 16V
Q6 = T2N7002AK,LM: as Q3 on sheet Battery_eFuse; (Id) @ 25°C: 200mA; Vgs (Max): *; Power Dissipation (Max): 320mW (Ta); Operating Temperature: -55C - 150C; Part Number: T2N7002AK,LM; Distributor Part Number: T2N7002AKLMCT-ND; Distributor: Digikey
R46 R47 = RMCF0603FT470K: as R56 on sheet Power_Path; Part Number: RMCF0603FT470K; Tolerance: 1%; Distributor: Digikey; Distributor Part Number: RMCF0603FT470KCT-ND; Case Code: 0603
R48 = RMCF0603FT6K19: 6.19 kOhms ±1% 0.1W, 1/10W Chip Resistor 0603 (1608 Metric) Automotive AEC-Q200 Thick Film; Part Number: RMCF0603FT6K19; Tolerance: 1%; Distributor: Digikey; Distributor Part Number: RMCF0603FT6K19CT-ND; Case Code: 0603
R49 = RMCF0603FT28K0: 28 kOhms ±1% 0.1W, 1/10W Chip Resistor 0603 (1608 Metric) Automotive AEC-Q200 Thick Film; Part Number: RMCF0603FT28K0; Tolerance: 1%; Distributor: Digikey; Distributor Part Number: RMCF0603FT28K0CT-ND; Case Code: 0603
R50 R52 = RMCF0603FT47K0: as R19 on sheet Battery_eFuse; Part Number: RMCF0603FT47K0; Tolerance: 1%; Distributor Part Number: RMCF0603FT47K0CT-ND; Distributor: Digikey; Case Code: 0603
R51 = RMCF0603FT1K2: 1.2 kOhms ±1% 0.1W, 1/10W Chip Resistor 0603 (1608 Metric) Automotive AEC-Q200 Thick Film; Part Number: RMCF0603FT1K2; Tolerance: 1%; Distributor: Digikey; Distributor Part Number: RMCF0603FT1K20CT-ND; Case Code: 0603
R53 = RMCF0603FT3K48: as R22 on sheet Battery_eFuse; Part Number: RMCF0603FT3K48; Tolerance: 1%; Distributor: Digikey; Distributor Part Number: RMCF0603FT3K48CT-ND; Case Code: 0603
U9 = TPS259474LRPWR: as U5 on sheet Battery_eFuse; Part Number: TPS259474LRPWR; Distributor: Digikey; Distributor Part Number: 296-TPS259474LRPWRCT-ND; Operating Temperature: -40°C ~ 125°C; Output Current: 5.5A; Voltage Input: 2.7V~23V

## Sheet Charger.SchDoc
size 297 x 209 mm; SheetNumber: 7; SheetTotal: 9
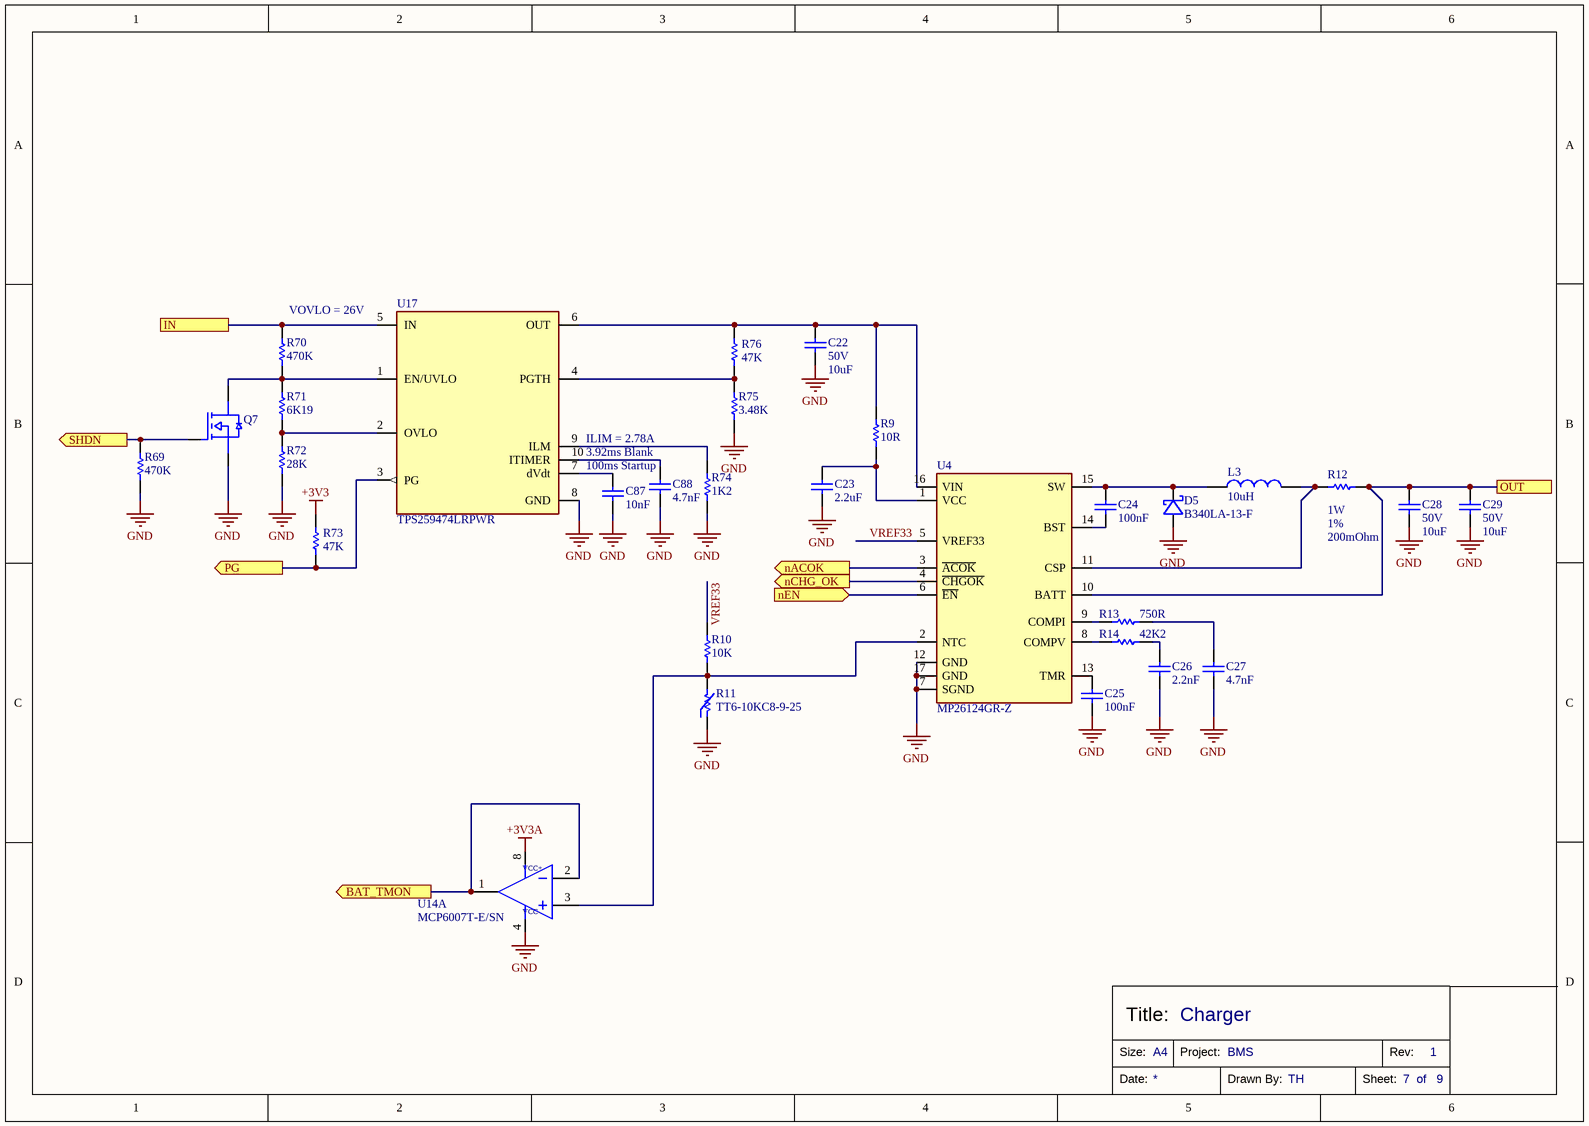
[diagram p5: Charger.SchDoc]

### Parts
C22  Voltage Rating: 50V  Capacitance: 10uF  [CAPC1210X090]  (hidden comment: CL32B106KBJNNNE)
C23  Capacitance: 2.2uF  [CAPC0805X060]  (hidden comment: CL21A225KBFNNNE)
C24  Capacitance: 100nF  [CAPC0603X040]  (hidden comment: C0603C104K5RACTU)
C25  Capacitance: 100nF  [CAPC0603X040]  (hidden comment: C0603C104K5RACTU)
C26  Capacitance: 2.2nF  [CAPC0603X060]  (hidden comment: CL10B222KB8WPNC)
C27  Capacitance: 4.7nF  [CAPC0603X040]  (hidden comment: C0603C472K4RECAUTO)
C28  Voltage Rating: 50V  Capacitance: 10uF  [CAPC1210X090]  (hidden comment: CL32B106KBJNNNE)
C29  Voltage Rating: 50V  Capacitance: 10uF  [CAPC1210X090]  (hidden comment: CL32B106KBJNNNE)
C87  Capacitance: 10nF  [CAPC0603X060]  (hidden comment: CL10B103KB8NNNC)
C88  Capacitance: 4.7nF  [CAPC0603X040]  (hidden comment: C0603C472K4RECAUTO)
D5  B340LA-13-F  [DO-214]
L3  Inductance: 10uH  [1274AS-H-100M=P3]  (hidden comment: 1274AS-H-100M=P3)
Q7  T2N7002AK,LM  [SOT23-3 MOSFET]  (value not drawn)
R9  Resistance: 10R  [RESC0603]  (hidden comment: RMCF0603FT10R0)
R10  Resistance: 10K  [RESC0603]  (hidden comment: RMCF0603FT10K0)
R11  TT6-10KC8-9-25  [TT6-10KC8-9-25]
R12  Power: 1W  Tolerance: 1%  Resistance: 200mOhm  [WSLT2512R2000FEB]  (hidden comment: WSLT2512R2000FEB)
R13  Resistance: 750R  [RESC0603]  (hidden comment: RMCF0603FT750R)
R14  Resistance: 42K2  [RESC0603]  (hidden comment: RMCF0603FT42K2)
R69  Resistance: 470K  [RESC0603]  (hidden comment: RMCF0603FT470K)
R70  Resistance: 470K  [RESC0603]  (hidden comment: RMCF0603FT470K)
R71  Resistance: 6K19  [RESC0603]  (hidden comment: RMCF0603FT6K19)
R72  Resistance: 28K  [RESC0603]  (hidden comment: RMCF0603FT28K0)
R73  Resistance: 47K  [RESC0603]  (hidden comment: RMCF0603FT47K0)
R74  Resistance: 1K2  [RESC0603]  (hidden comment: RMCF0603FT1K2)
R75  Resistance: 3.48K  [RESC0603]  (hidden comment: RMCF0603FT3K48)
R76  Resistance: 47K  [RESC0603]  (hidden comment: RMCF0603FT47K0)
U4  MP26124GR-Z  [qfn-16]
U14  MCP6007T-E/SN  [SOIC-8]  (part A of 2)
U17  TPS259474LRPWR  [VFQFN-10]

### Ports
BAT_TMON (out, see Power_Path[3B], Controller[2B]), IN (see Power_Path[3B], Umbilical_eFuse[2B]), nACOK (out, see Power_Path[3B], Controller[4B]), nCHG_OK (out, see Power_Path[3B], Controller[4B]), nEN (in, see Power_Path[3B]), OUT (see Power_Path[3B], MPPT[6A]), PG (out, see Power_Path[3B]), SHDN (out, see Power_Path[3B])

### Nets
+3V3: R73.2
+3V3A: U14.8(VCC+)
GND: C22.1 C23.1 C25.1 C26.1 C27.1 C28.1 C29.1 C87.2 C88.2 D5.A Q7.S R11.1 R69.1 R72.1 R74.1 R75.1 U4.7(SGND) U4.12(GND) U4.17(GND) U14.4(VCC-) U17.8(GND)
VREF33: R10.2 U4.5(VREF33)
NetC6_2: C28.2 C29.2 R12.2 U4.10(BATT) ; port OUT
NetC22_2: C22.2 R9.2 R76.2 U4.16(VIN) U17.6(OUT)
NetC23_2: C23.2 R9.1 U4.1(VCC)
NetC24_1: C24.1 U4.14(BST)
NetC24_2: C24.2 D5.K L3.1 U4.15(SW)
NetC25_2: C25.2 U4.13(TMR)
NetC26_2: C26.2 R14.1
NetC27_2: C27.2 R13.2
NetC59_2: R70.2 U17.5(IN) ; port IN
NetC87_1: C87.1 U17.7(dVdt)
NetC88_1: C88.1 U17.10(ITIMER)
NetL3_2: L3.2 R12.1 U4.11(CSP)
NetQ3_G: Q7.G R69.2 ; port SHDN
NetQ7_D: Q7.D R70.1 R71.2 U17.1(EN/UVLO)
NetR10_1: R10.1 R11.2 U4.2(NTC) U14.3(INA+)
NetR13_1: R13.1 U4.9(COMPI)
NetR14_2: R14.2 U4.8(COMPV)
NetR19_1: R73.1 U17.3(PG) ; port PG
NetR71_1: R71.1 R72.2 U17.2(OVLO)
NetR74_2: R74.2 U17.9(ILM)
NetR75_2: R75.2 R76.1 U17.4(PGTH)
NetU4_3: U4.3(~{ACOK}) ; port nACOK
NetU4_4: U4.4(~{CHGOK}) ; port nCHG_OK
NetU4_6: U4.6(~{EN}) ; port nEN
NetU8_22: U14.1(OUTA) U14.2(INA-) ; port BAT_TMON

### Notes on the sheet
- (near R70) VOVLO = 26V
- ILIM = 2.78A
- 3.92ms Blank
- 100ms Startup
- Charger
- Size:
- Title:
- A4
- Project:
- Rev:
- Date:
- Drawn By:
- Sheet:
- of

### Library data of the parts
C22 C28 C29 = CL32B106KBJNNNE: as C19 on sheet Power_Path; Manufacturer Part Number: CL32B106KBJNNNE; Distributor Part Number: 1276-3387-1-ND; Tolerance: 10%; Case Code: 1210; Distributor: Digikey
C23 = CL21A225KBFNNNE: 2.2uF ±10% 25V Ceramic Capacitor X7R 0805 (2012 Metric); Part Number: CL21A225KBFNNNE; Distributor Part Number: 1276-6702-1-ND; Tolerance: 10%; Case Code: 0805; Distributor: Digikey; Voltage Rating: 25V
C24 C25 = C0603C104K5RACTU: as C49 on sheet Power_Path; Part Number: C0603C104K5RACTU; Distributor Part Number: 399-C0603C104K5RACTUCT-ND; Tolerance: 10%; Case Code: 0603; Distributor: Digikey; Voltage Rating: 50V
C26 = CL10B222KB8WPNC: 2.2nF ±10% 50V Ceramic Capacitor X7R 0603 (1608 Metric); Part Number: CL10B222KB8WPNC; Distributor Part Number: 1276-6530-1-ND; Tolerance: 10%; Case Code: 0805; Distributor: Digikey; Voltage Rating: 50V
C27 C88 = C0603C472K4RECAUTO: as C31 on sheet Battery_eFuse; Part Number: C0603C472K4RECAUTO; Tolerance: 10%; Distributor Part number: 399-17879-1-ND; Case Code: 0603; Distributor: Digikey; Dielectric: X7R; Voltage Rating: 16V
C87 = CL10B103KB8NNNC: as C30 on sheet Battery_eFuse; Part Number: CL10B103KB8NNNC; Distributor Part Number: 1276-1009-1-ND; Tolerance: 10%; Case Code: 0603; Distributor: Digikey; Voltage Rating: 50V
D5 = B340LA-13-F: Diode Schottky 40V 3A 450mV FVf Fast Recovery; Part Number: B340LA-13-F; Distributor: Digikey; Distributor Part Number: B340LA-FDICT-ND; Operating Temperature: -55°C ~ 125°C; Voltage - DC Reverse (Max): 40V; Current - Average Rectified: 3A; Voltage - Foward: 450mV
L3 = 1274AS-H-100M=P3: Inductor 10 µH , 4.4 A 30.4mOhm Max Shielded Drum Core; Current Rating: 4.4A; Saturation Current: 6.2A; Part Number: 1274AS-H-100M=P3; Distributor Part Number: 490-10846-1-ND; Distributor: Digikey; DCR: 30.4mOhm
Q7 = T2N7002AK,LM: as Q3 on sheet Battery_eFuse; (Id) @ 25°C: 200mA; Vgs (Max): *; Power Dissipation (Max): 320mW (Ta); Operating Temperature: -55C - 150C; Part Number: T2N7002AK,LM; Distributor Part Number: T2N7002AKLMCT-ND; Distributor: Digikey
R9 = RMCF0603FT10R0: 10 Ohms ±1% 0.1W, 1/10W Chip Resistor 0603 (1608 Metric) Automotive AEC-Q200 Thick Film; Part Number: RMCF0603FT10R0; Tolerance: 1%; Distributor: Digikey; Distributor Part Number: RMCF0603FT10R0CT-ND; Case Code: 0603
R10 = RMCF0603FT10K0: as R55 on sheet Power_Path; Part Number: RMCF0603FT10K0; Tolerance: 1%; Distributor: Digikey; Distributor Part Number: RMCF0603FT10K0CT-ND; Case Code: 0603
R11 = TT6-10KC8-9-25: NTC Thermistor 10k Probe; Part Number: TT6-10KC8-9-25; Distributor Part Number: 1912-TT6-10KC8-9-25-ND; Distributor: Digikey; Operating Temperature: -30°C ~ 120°C; Resistance @ 25C: 10k
R12 = WSLT2512R2000FEB: 200 mOhms ±1% 1W Chip Resistor 2512 (6332 Metric) Anti-Sulfur, Automotive AEC-Q200, Current Sense, Moisture Resistant, Pulse Withstanding Metal Element; Distributor: Digikey; Distributor Part Number: 541-10376-1-ND; Operating Temperature: -65°C ~ 275°C; Package: 2512; Part Number: WSLT2512R2000FEB
R13 = RMCF0603FT750R: as R20 on sheet Battery_eFuse; Part Number: RMCF0603FT750R; Tolerance: 1%; Distributor: Digikey; Distributor Part Number: RMCF0603FT750RCT-ND; Case Code: 0603
R14 = RMCF0603FT42K2: 42.2 kOhms ±1% 0.1W, 1/10W Chip Resistor 0603 (1608 Metric) Automotive AEC-Q200 Thick Film; Part Number: RMCF0603FT42K2; Tolerance: 1%; Distributor: Digikey; Distributor Part Number: RMCF0603FT42K2CT-ND; Case Code: 0603
R69 R70 = RMCF0603FT470K: as R56 on sheet Power_Path; Part Number: RMCF0603FT470K; Tolerance: 1%; Distributor: Digikey; Distributor Part Number: RMCF0603FT470KCT-ND; Case Code: 0603
R71 = RMCF0603FT6K19: as R48 on sheet Umbilical_eFuse; Part Number: RMCF0603FT6K19; Tolerance: 1%; Distributor: Digikey; Distributor Part Number: RMCF0603FT6K19CT-ND; Case Code: 0603
R72 = RMCF0603FT28K0: as R49 on sheet Umbilical_eFuse; Part Number: RMCF0603FT28K0; Tolerance: 1%; Distributor: Digikey; Distributor Part Number: RMCF0603FT28K0CT-ND; Case Code: 0603
R73 R76 = RMCF0603FT47K0: as R19 on sheet Battery_eFuse; Part Number: RMCF0603FT47K0; Tolerance: 1%; Distributor Part Number: RMCF0603FT47K0CT-ND; Distributor: Digikey; Case Code: 0603
R74 = RMCF0603FT1K2: as R51 on sheet Umbilical_eFuse; Part Number: RMCF0603FT1K2; Tolerance: 1%; Distributor: Digikey; Distributor Part Number: RMCF0603FT1K20CT-ND; Case Code: 0603
R75 = RMCF0603FT3K48: as R22 on sheet Battery_eFuse; Part Number: RMCF0603FT3K48; Tolerance: 1%; Distributor: Digikey; Distributor Part Number: RMCF0603FT3K48CT-ND; Case Code: 0603
U4 = MP26124GR-Z: Charger IC Lithium Ion 24V Input, 2A, 600kHz, 4S Cell Switching; Battery Pack Voltage: 16.8V; Part Number: MP26124GR-Z; Distributor: Digikey; Distributor Part Number: 1589-1993-1-ND; Operating Temperature: -20C~125C; Voltage Supply (Max): 24V
U14 = MCP6007T-E/SN: as U11 on sheet Power_Path; Part Number: MCP6007T-E/SN; Distributor: Digikey; Distributor Part Number: 150-MCP6007T-E/SNCT-ND; Input Voltage: 1.8V ~ 5.5V; Operating Temperature: -40°C ~ 125°C; Gain Bandwidth Product: 1MHz
U17 = TPS259474LRPWR: as U5 on sheet Battery_eFuse; Part Number: TPS259474LRPWR; Distributor: Digikey; Distributor Part Number: 296-TPS259474LRPWRCT-ND; Operating Temperature: -40°C ~ 125°C; Output Current: 5.5A; Voltage Input: 2.7V~23V

## Sheet MPPT.SchDoc
size 297 x 209 mm; SheetNumber: 6; SheetTotal: 9
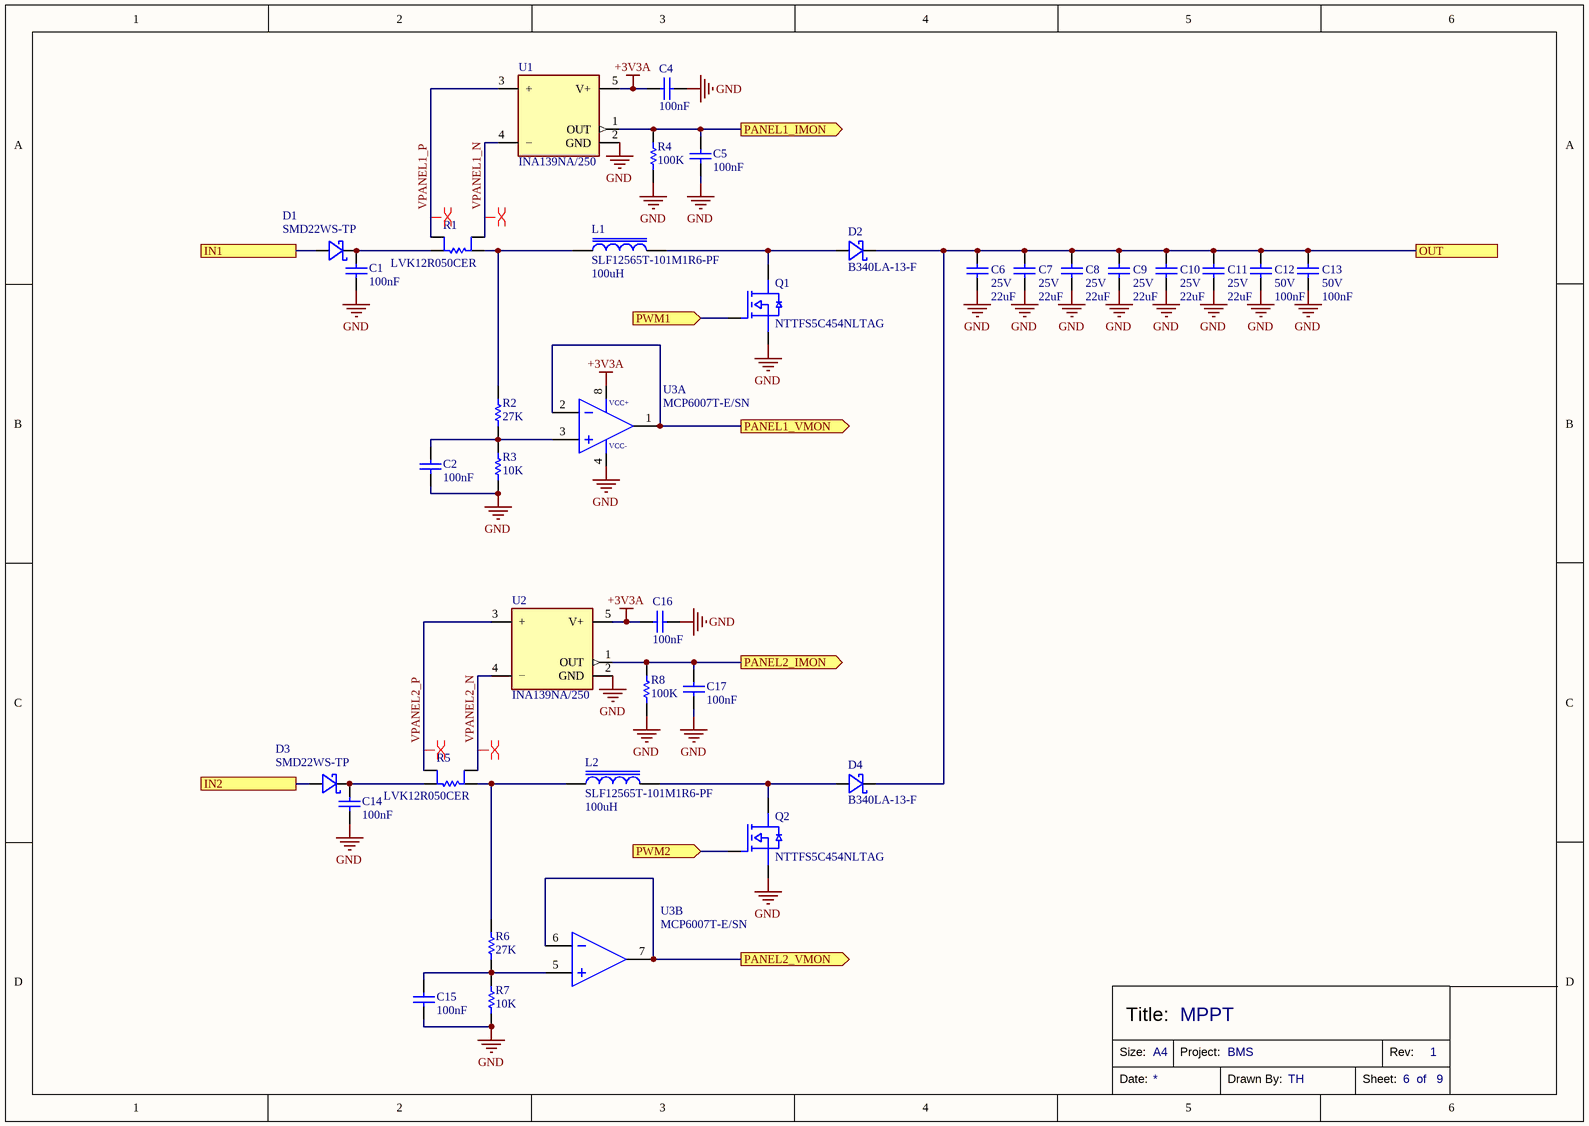
[diagram p6: MPPT.SchDoc]

### Parts
C1  Capacitance: 100nF  [CAPC0603X040]  (hidden comment: C0603C104K5RACTU)
C2  Capacitance: 100nF  [CAPC0603X040]  (hidden comment: C0603C104K5RACTU)
C4  Capacitance: 100nF  [CAPC0603X040]  (hidden comment: C0603C104K5RACTU)
C5  Capacitance: 100nF  [CAPC0603X040]  (hidden comment: C0603C104K5RACTU)
C6  Voltage Rating: 25V  Capacitance: 22uF  [CAPC1210X090]  (hidden comment: CL32B226KAJNNNE)
C7  Voltage Rating: 25V  Capacitance: 22uF  [CAPC1210X090]  (hidden comment: CL32B226KAJNNNE)
C8  Voltage Rating: 25V  Capacitance: 22uF  [CAPC1210X090]  (hidden comment: CL32B226KAJNNNE)
C9  Voltage Rating: 25V  Capacitance: 22uF  [CAPC1210X090]  (hidden comment: CL32B226KAJNNNE)
C10  Voltage Rating: 25V  Capacitance: 22uF  [CAPC1210X090]  (hidden comment: CL32B226KAJNNNE)
C11  Voltage Rating: 25V  Capacitance: 22uF  [CAPC1210X090]  (hidden comment: CL32B226KAJNNNE)
C12  Voltage Rating: 50V  Capacitance: 100nF  [CAPC0603X040]  (hidden comment: C0603C104K5RACTU)
C13  Voltage Rating: 50V  Capacitance: 100nF  [CAPC0603X040]  (hidden comment: C0603C104K5RACTU)
C14  Capacitance: 100nF  [CAPC0603X040]  (hidden comment: C0603C104K5RACTU)
C15  Capacitance: 100nF  [CAPC0603X040]  (hidden comment: C0603C104K5RACTU)
C16  Capacitance: 100nF  [CAPC0603X040]  (hidden comment: C0603C104K5RACTU)
C17  Capacitance: 100nF  [CAPC0603X040]  (hidden comment: C0603C104K5RACTU)
D1  SMD22WS-TP  [SOD-323]
D2  B340LA-13-F  [DO-214]
D3  SMD22WS-TP  [SOD-323]
D4  B340LA-13-F  [DO-214]
L1  SLF12565T-101M1R6-PF  Inductance: 100uH  [SLF12565T-101M1R6-PF]
L2  SLF12565T-101M1R6-PF  Inductance: 100uH  [SLF12565T-101M1R6-PF]
Q1  NTTFS5C454NLTAG  [NTTFS5C454NLTAG]
Q2  NTTFS5C454NLTAG  [NTTFS5C454NLTAG]
R1  LVK12R050CER  [LVK12R050CER-1]
R2  Resistance: 27K  [RESC0603]  (hidden comment: RMCF0603FT27K0)
R3  Resistance: 10K  [RESC0603]  (hidden comment: RMCF0603FT10K0)
R4  Resistance: 100K  [RESC0603]  (hidden comment: RMCF0603FT100K)
R5  LVK12R050CER  [LVK12R050CER-2]
R6  Resistance: 27K  [RESC0603]  (hidden comment: RMCF0603FT27K0)
R7  Resistance: 10K  [RESC0603]  (hidden comment: RMCF0603FT10K0)
R8  Resistance: 100K  [RESC0603]  (hidden comment: RMCF0603FT100K)
U1  INA139NA/250  [SOT23-5 IC]
U2  INA139NA/250  [SOT23-5 IC]
U3  MCP6007T-E/SN  [SOIC-8]  (parts A,B of 2)

### Ports
IN1 (see Power_Path[3C]), IN2 (see Power_Path[3C]), OUT (see Power_Path[3C], Charger[6B]), PANEL1_IMON (out, see Power_Path[3C], Controller[2B]), PANEL1_VMON (out, see Power_Path[3C], Controller[2B]), PANEL2_IMON (out, see Power_Path[3C], Controller[2B]), PANEL2_VMON (out, see Power_Path[3C], Controller[2B]), PWM1 (in, see Power_Path[3C]), PWM2 (in, see Power_Path[3C])

### Nets
+3V3A: C4.2 C16.2 U1.5(V+) U2.5(V+) U3.8(VCC+)
GND: C1.1 C2.1 C4.1 C5.1 C6.1 C7.1 C8.1 C9.1 C10.1 C11.1 C12.1 C13.1 C14.1 C15.1 C16.1 C17.1 Q1.S Q2.S R3.1 R4.1 R7.1 R8.1 U1.2(GND) U2.2(GND) U3.4(VCC-)
VPANEL1_N: R1.3 U1.4(−)
VPANEL1_P: R1.2 U1.3(+)
VPANEL2_N: R5.3 U2.4(−)
VPANEL2_P: R5.2 U2.3(+)
NetC1_2: C1.2 D1.K R1.1
NetC2_2: C2.2 R2.1 R3.2 U3.3(INA+)
NetC5_2: C5.2 R4.2 U1.1(OUT) ; port PANEL1_IMON
NetC6_2: C6.2 C7.2 C8.2 C9.2 C10.2 C11.2 C12.2 C13.2 D2.K D4.K ; port OUT
NetC14_2: C14.2 D3.K R5.1
NetC15_2: C15.2 R6.1 R7.2 U3.5(INB+)
NetC17_2: C17.2 R8.2 U2.1(OUT) ; port PANEL2_IMON
NetD1_A: D1.A ; port IN1
NetD2_A: D2.A L1.1 Q1.D
NetD3_A: D3.A ; port IN2
NetD4_A: D4.A L2.1 Q2.D
NetL1_2: L1.2 R1.4 R2.2
NetL2_2: L2.2 R5.4 R6.2
NetQ1_G: Q1.G ; port PWM1
NetQ2_G: Q2.G ; port PWM2
NetU3_1: U3.1(OUTA) U3.2(INA-) ; port PANEL1_VMON
NetU3_6: U3.6(INB-) U3.7(OUTB) ; port PANEL2_VMON

### Layout directives
differential pair: VPANEL1_N, VPANEL1_P, VPANEL2_N, VPANEL2_P

### Notes on the sheet
- MPPT
- Size:
- Title:
- A4
- Project:
- Rev:
- Date:
- Drawn By:
- Sheet:
- of

### Library data of the parts
C1 C2 C4 C5 C12-C17 = C0603C104K5RACTU: as C49 on sheet Power_Path; Part Number: C0603C104K5RACTU; Distributor Part Number: 399-C0603C104K5RACTUCT-ND; Tolerance: 10%; Case Code: 0603; Distributor: Digikey
  C1 C2 C4 C5 C14-C17: Voltage Rating: 50V
C6-C11 = CL32B226KAJNNNE: 22 µF ±10% 25V Ceramic Capacitor X7R 1210 (3225 Metric); Part Number: CL32B226KAJNNNE; Distributor Part Number: 1276-3392-1-ND; Tolerance: 10%; Case Code: 1210; Distributor: Digikey
D1 D3 = SMD22WS-TP: Diode Schottky 20V 2A Fast Recovery; fORWARD vOLTAGE: 550mV; Part Number: SMD22WS-TP; Distributor: Digikey; Distributor Part Number: SMD22WS-TPMSCT-ND; Operating Temperature: -55°C ~ 125°C; Voltage - DC Reverse: 20V; Current - Average: 2A
D2 D4 = B340LA-13-F: as D5 on sheet Charger; Part Number: B340LA-13-F; Distributor: Digikey; Distributor Part Number: B340LA-FDICT-ND; Operating Temperature: -55°C ~ 125°C; Voltage - DC Reverse (Max): 40V; Current - Average Rectified: 3A; Voltage - Foward: 450mV
L1 L2 = SLF12565T-101M1R6-PF: Inductor 100uH Shielded Drum Core, 1.9A 148mOhm; Saturation Current: 1.6A; Part Number: SLF12565T-101M1R6-PF; Distributor: Digikey; Distributor Part Number: 445-174227-1-ND; Operating Temperature: -20°C ~ 105°C; Current Rating: 1.9A; DC Resistance: 148mOhm
Q1 Q2 = NTTFS5C454NLTAG: N-MOSFET 40 V , 85 A, 3.8 mΩ Rds(on) @ 10 V, WDFN-8 3.3×3.3 mm, low Qg (~18 nC); Manufacturer: Onsemi; Vdss: 40V; Current - Continuous Drain (Id): 20A; Rds On (Max): 3.8mOhm; Gate Charge (Qg) (Max) @ Vgs: 18nC @ 10V; Vgs (Max): 20V; Power Dissipation (Max) (Ta): 3.2W; Part Number: NTTFS5C454NL; Distributor: Mouser; Distributor Part Number: 863-NTTFS5C454NLTAG; Operating Temperature: -55°C ~ 175°C; ComponentLink1Description: Datasheet; ComponentLink1URL: https://www.onsemi.com/pdf/datasheet/nttfs5c454nl-d.pdf
R1 R5 = LVK12R050CER: as R58 on sheet Power_Path; Part Number: LVK12R050CER; Distributor: Mouser; Distributor Part Number: 588-LVK12R050CER; Power: 0.5W; Tolerance: 0.25%
R2 R6 = RMCF0603FT27K0: 27 kOhms ±1% 0.1W, 1/10W Chip Resistor 0603 (1608 Metric) Automotive AEC-Q200 Thick Film; Part Number: RMCF0603FT27K0; Tolerance: 1%; Distributor: Digikey; Distributor Part Number: RMCF0603FT27K0CT-ND; Case Code: 0603
R3 R7 = RMCF0603FT10K0: as R55 on sheet Power_Path; Part Number: RMCF0603FT10K0; Tolerance: 1%; Distributor: Digikey; Distributor Part Number: RMCF0603FT10K0CT-ND; Case Code: 0603
R4 R8 = RMCF0603FT100K: as R57 on sheet Power_Path; Part Number: RMCF0603FT100K; Tolerance: 1%; Distributor: Digikey; Distributor Part Number: RMCF0603FT100KCT-ND; Case Code: 0603
U1 U2 = INA139NA/250: as U10 on sheet Power_Path; Distributor: Digikey; Distributor Part Number: INA139NA/250CT-ND; Operating Temperature: -40°C ~ 125°C; Part Number: INA139NA/250
U3 = MCP6007T-E/SN: as U11 on sheet Power_Path; Part Number: MCP6007T-E/SN; Distributor: Digikey; Distributor Part Number: 150-MCP6007T-E/SNCT-ND; Input Voltage: 1.8V ~ 5.5V; Operating Temperature: -40°C ~ 125°C; Gain Bandwidth Product: 1MHz